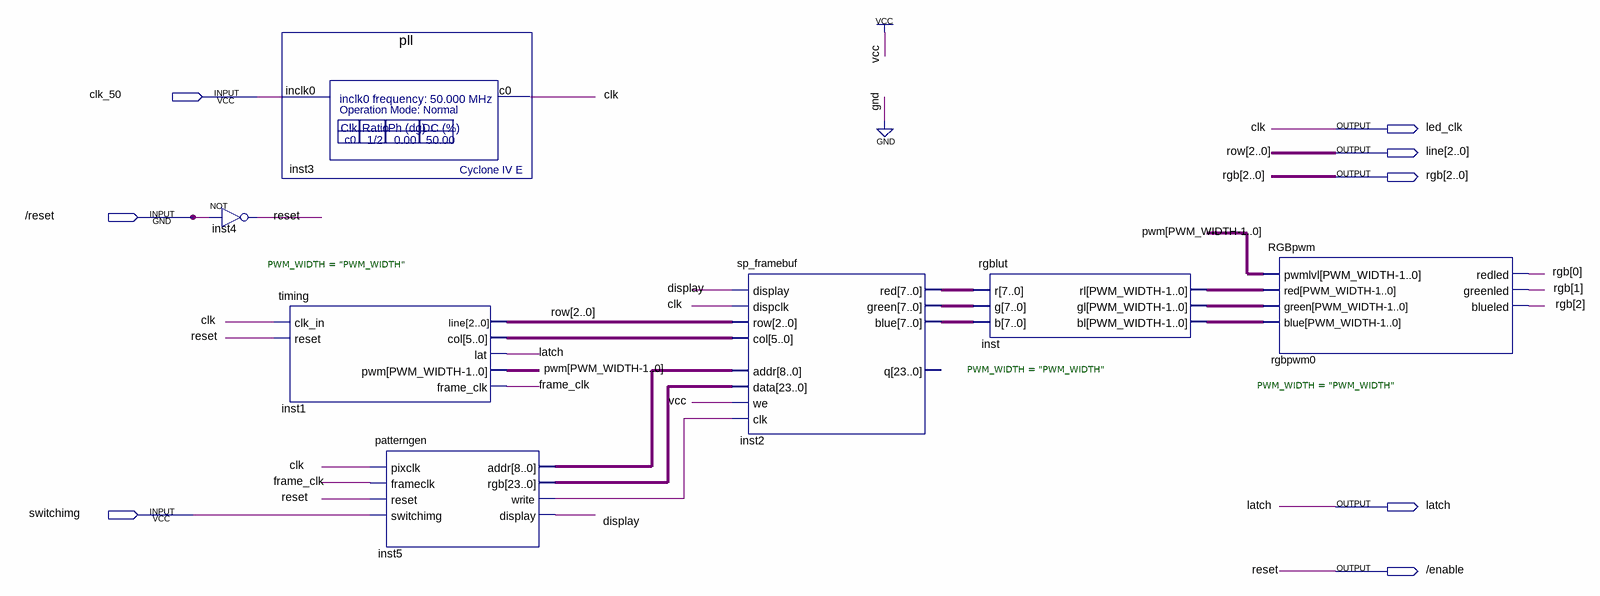
[diagram p0: schematic sheet]
// Quartus schematic LEDpanel.bdf as structural Verilog: 7 symbols, 8 pins
module LEDpanel (
  input  clk_50,
  input  \/reset ,
  input  switchimg,
  output led_clk,
  output [2:0] line,
  output [2:0] rgb,
  output latch,
  output \/enable 
);

  wire display, frame_clk, inst5_write, inst_bl, inst_gl, inst_rl, \pwm[PWM_WIDTH-1..0] ;
  wire [5:0] inst1_col;
  wire [7:0] inst2_blue, inst2_green, inst2_red;
  wire [8:0] inst5_addr;
  wire [23:0] inst5_rgb;

  not inst4 (\/enable , \/reset );
  pll inst3 (.inclk0(clk_50), .c0(led_clk));
  timing #(.PWM_WIDTH("PWM_WIDTH")) inst1 (
    .clk_in(led_clk), .reset(\/enable ), .line(line), .col(inst1_col), .lat(latch),
    .pwm(\pwm[PWM_WIDTH-1..0] ), .frame_clk(frame_clk));
  patterngen inst5 (
    .pixclk(led_clk), .frameclk(frame_clk), .reset(\/enable ), .switchimg(switchimg), .addr(inst5_addr),
    .rgb(inst5_rgb), .write(inst5_write), .display(display));
  sp_framebuf inst2 (
    .display(display), .dispclk(led_clk), .row(line), .col(inst1_col), .addr(inst5_addr), .we(1'b1),
    .clk(inst5_write), .data(inst5_rgb), .red(inst2_red), .green(inst2_green), .blue(inst2_blue));  // open: q
  rgblut #(.PWM_WIDTH("PWM_WIDTH")) inst (
    .r(inst2_red), .g(inst2_green), .b(inst2_blue), .rl(inst_rl), .gl(inst_gl), .bl(inst_bl));
  RGBpwm #(.PWM_WIDTH("PWM_WIDTH")) rgbpwm0 (
    .pwmlvl(\pwm[PWM_WIDTH-1..0] ), .red(inst_rl), .green(inst_gl), .blue(inst_bl), .redled(rgb[0]),
    .greenled(rgb[1]), .blueled(rgb[2]));

  // Other names for the same wires on the sheet: clk = led_clk; reset = \/enable ; row[2:0] = line
endmodule
